# Altium schematic sheet BulbCommander1.SchDoc
size A4
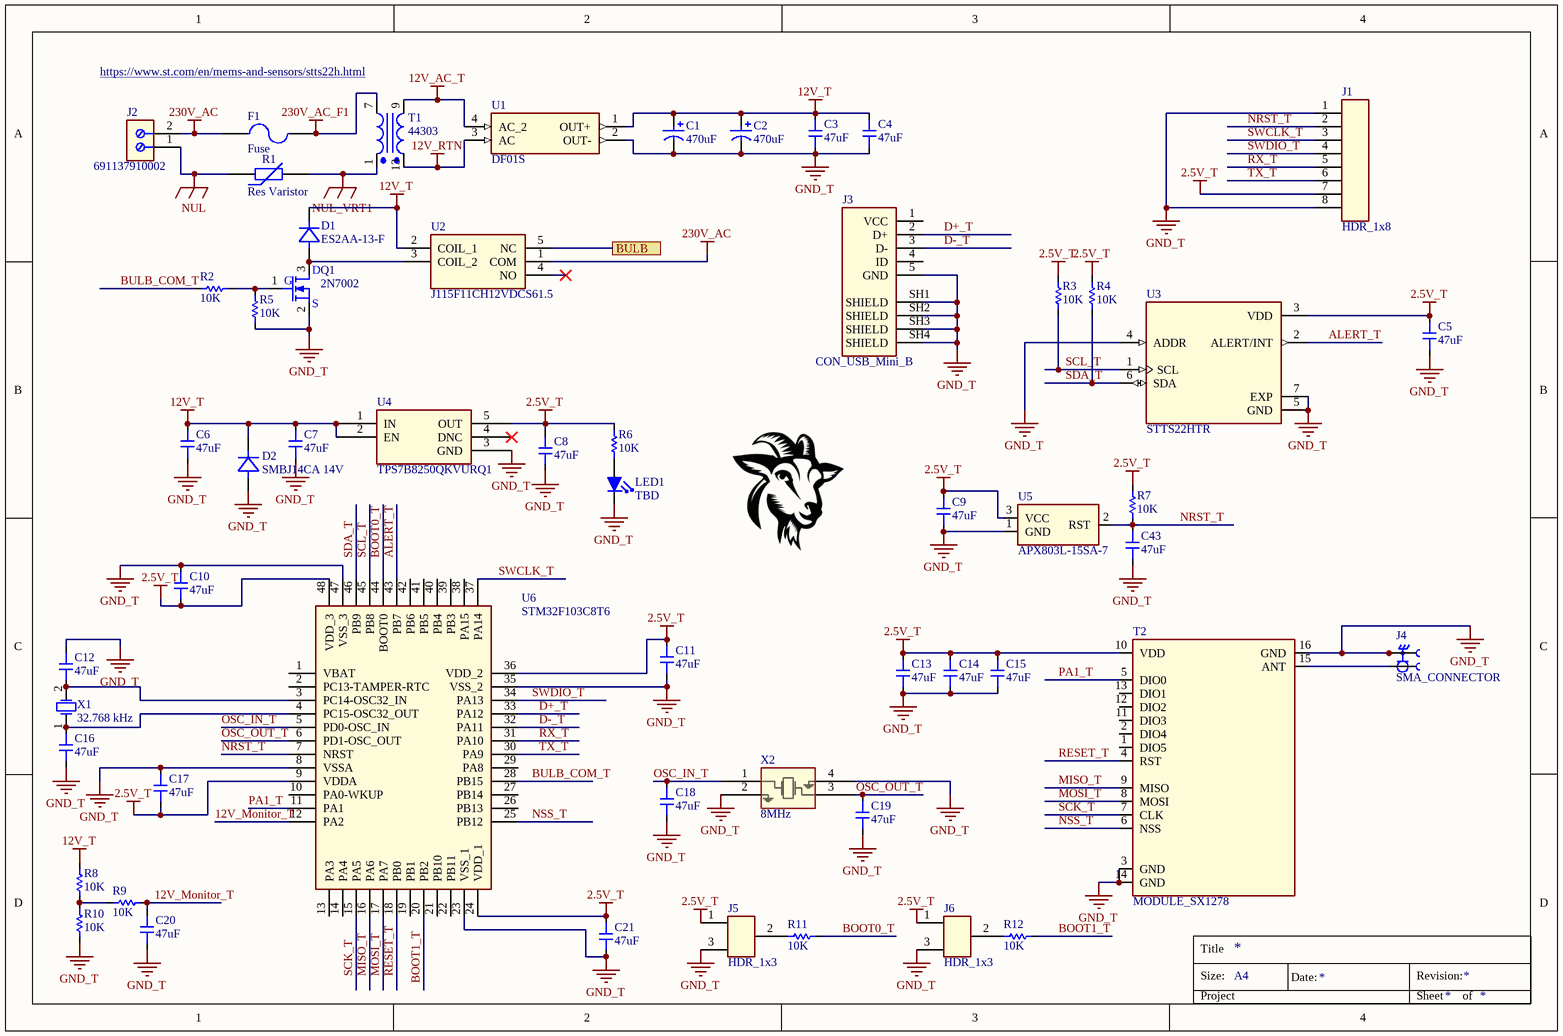
[diagram p0: BulbCommander1.SchDoc]

## Parts
C1  value 470uF  [WCAP-ASLL_D16H17]  (hidden comment: Cap Pol1)
C2  value 470uF  [WCAP-ASLL_D16H17]  (hidden comment: Cap Pol1)
C3  47uF  [2220]
C4  47uF  [2220]
C5  47uF  [CASE0603]
C6  47uF  [1206]
C7  47uF  [1206]
C8  47uF  [1206]
C9  47uF  [CASE0603]
C10  47uF  [CASE0603]
C11  47uF  [CASE0603]
C12  47uF  [CASE0603]
C13  47uF  [CASE0603]
C14  47uF  [CASE0603]
C15  47uF  [CASE0603]
C16  47uF  [CASE0603]
C17  47uF  [CASE0603]
C18  47uF  [CASE0603]
C19  47uF  [CASE0603]
C20  47uF  [CASE0603]
C21  47uF  [CASE0603]
C43  47uF  [CASE0603]
D1  ES2AA-13-F  [SMA_DIODE]
D2  SMBJ14CA 14V  [SMBJSeries_LTF-M]
F1  Fuse  [FUSE]
J1  HDR_1x8  [Header_1x8_2.54_Male]
J2  691137910002  [691137910002]
J3  CON_USB_Mini_B  [CUI_UJ2-MBH-4-SMT]
J4  SMA_CONNECTOR  [LPRS_SMA_CONNECTOR]
J5  HDR_1x3  [Header_1x3_2.54_Male]
J6  HDR_1x3  [Header_1x3_2.54_Male]
LED1  TBD  [CASE0603]
Q1  2N7002  [SOT23-3]
R1  Res Varistor  [AXIAL-0.3]
R2  10K  [CASE0603]
R3  10K  [CASE0603]
R4  10K  [CASE0603]
R5  10K  [CASE0603]
R6  10K  [CASE0603]
R7  10K  [CASE0603]
R8  10K  [CASE0603]
R9  10K  [CASE0603]
R10  10K  [CASE0603]
R11  10K  [CASE0603]
R12  10K  [CASE0603]
T1  44303  [TRAF_44303]
T2  MODULE_SX1278  [LORA SX1278]
U1  DF01S  [SOT508P985X260-4N]
U2  J115F11CH12VDCS61.5  [J115F11CH12VDCS615U]
U3  STTS22HTR  [Sensor_6-UDFN]
U4  TPS7B8250QKVURQ1  [SOT_QKVURQ1_TEX]
U5  APX803L-15SA-7  [SOT23-3]
U6  STM32F103C8T6  [QFP50P900X900X160-48N]
X1  32.768 kHz  [XTAL_ECS-.327-12.5-34B-C-TR]
X2  8MHz  [XTAL4P_ABM3B_ABR]

## Ports
BULB

## Nets
2.5V_T: C5.2 C8.2 C9.2 C10.1 C11.2 C13.2 C14.2 C15.2 C17.2 C21.2 J1.7 J5.1 J6.1 R3.2 R4.2 R6.2 R7.2 T2.10(VDD) U3.3(VDD) U4.5(OUT) U5.3(VCC) U6.9(VDDA) U6.24(VDD_1) U6.36(VDD_2) U6.48(VDD_3)
12V_AC_T: T1.9(PRI1) U1.4(AC_2)
12V_RTN: T1.13(SEC) U1.3(AC)
12V_T: C1.1 C2.1 C3.2 C4.2 C6.2 C7.2 D1.1 D2.1 R8.2 U1.1(OUT+) U2.2(COIL_1) U4.1(IN) U4.2(EN)
230V_AC: F1.1 J2.2 U2.1(COM)
230V_AC_F1: F1.2 T1.7(PRI1)
GND_T: C1.2 C2.2 C3.1 C4.1 C5.1 C6.1 C7.1 C8.1 C9.1 C10.2 C11.1 C12.2 C13.1 C14.1 C15.1 C16.2 C17.1 C18.2 C19.2 C20.2 C21.1 C43.1 D2.2 J1.1 J1.8 J3.5(GND) J3.SH1(SHIELD) J3.SH2(SHIELD) J3.SH3(SHIELD) J3.SH4(SHIELD) J4.G1 J4.G2 J4.G3 J4.G4 J5.3 J6.3 LED1.2(K) Q1.2(S) R5.1 R10.1 T2.3(GND) T2.14(GND) T2.16(GND) U1.2(OUT-) U3.4(ADDR) U3.5(GND) U3.7(EXP) U4.3(GND) U5.1(GND) U6.8(VSSA) U6.23(VSS_1) U6.35(VSS_2) U6.47(VSS_3) X2.2 X2.4
NUL: J2.1 R1.1
NUL_VRT1: R1.2 T1.1(PRI1)
12V_Monitor_T: C20.1 R9.2 U6.12(PA2)
ALERT_T: U3.2(ALERT/INT) U6.43(PB7)
BOOT0_T: R11.1 U6.44(BOOT0)
BOOT1_T: R12.1 U6.20(PB2)
BULB: U2.5(NC) ; port BULB
BULB_COM_T: R2.2 U6.28(PB15)
D+_T: J3.2(D+) U6.33(PA12)
D-_T: J3.3(D-) U6.32(PA11)
MISO_T: T2.9(MISO) U6.16(PA6)
MOSI_T: T2.8(MOSI) U6.17(PA7)
NRST_T: C43.2 J1.2 R7.1 U5.2(RST) U6.7(NRST)
NSS_T: T2.6(NSS) U6.25(PB12)
OSC_IN_T: C18.1 U6.5(PD0-OSC_IN) X2.1
OSC_OUT_T: C19.1 U6.6(PD1-OSC_OUT) X2.3
PA1_T: T2.5(DIO0) U6.11(PA1)
RESET_T: T2.4(RST) U6.18(PB0)
RX_T: J1.5 U6.31(PA10)
SCK_T: T2.7(CLK) U6.15(PA5)
SCL_T: R3.1 U3.1(SCL) U6.45(PB8)
SDA_T: R4.1 U3.6(SDA) U6.46(PB9)
SWCLK_T: J1.3 U6.37(PA14)
SWDIO_T: J1.4 U6.34(PA13)
TX_T: J1.6 U6.30(PA9)
NetC12_1: C12.1 U6.3(PC14-OSC32_IN) X1.2(OSC2)
NetC16_1: C16.1 U6.4(PC15-OSC32_OUT) X1.1(OSC1)
NetD1_2: D1.2 Q1.3(D) U2.3(COIL_2)
NetJ4_1: J4.1 T2.15(ANT)
NetJ5_2: J5.2 R11.2
NetJ6_2: J6.2 R12.2
NetLED1_1: LED1.1(A) R6.1
NetQ1_1: Q1.1(G) R2.1 R5.2
NetR8_1: R8.1 R9.1 R10.2

Not connected (* = marked no-connect by the designer): J3 1(VCC) 4(ID); T2 1(DIO5) 2(DIO4) 11(DIO3) 12(DIO2) 13(DIO1); U2 4(NO)*; U4 4(DNC)*; U6 1(VBAT) 2(PC13-TAMPER-RTC) 10(PA0-WKUP) 13(PA3) 14(PA4) 19(PB1) 21(PB10) 22(PB11) 26(PB13) 27(PB14) 29(PA8) 38(PA15) 39(PB3) 40(PB4) 41(PB5) 42(PB6)

## Notes on the sheet
- https://www.st.com/en/mems-and-sensors/stts22h.html
- Title
- Size:
- A4
- Date:
- Revision:
- Project
- Sheet
- of

## Library data of the parts
C1 C2 = Capacitor_Pol_470uF: Published: 8-Jun-2000; LatestRevisionDate: 17-Jul-2002; LatestRevisionNote: Re-released for DXP Platform.; PackageReference: RB7.6-15; Publisher: Altium Limited; PackageDescription: Polarized Capacitor (Radial); 2 Leads
C3 C4 = Capacitor_47uF_2220: CAP CER 47uF 20% 35V X7R 2220; MFR: TBD; MFR PN: TBD; Supplier: TBD; Supplier PN: TBD; Datasheet: TBD
C5-C21 C43 = Capacitor_47uF_1206: CAP CER 47uF 20% 35V X7R 2220; MFR: TBD; MFR PN: TBD; Supplier: TBD; Supplier PN: TBD; Datasheet: TBD
D1 = Diode_SMA: DIODE STANDARD 50V 2A SMA; MFR: Diodes Incoprated; MFR PN: ES2AA-13-F; SUpplier: DigiKey; Supplier PN: ES2AA-FDICT-ND; Datasheet: https://www.digikey.ro/en/products/detail/diodes-incorporated/ES2AA-13-F/765452?curr=usd&utm_campaign=buynow&utm_medium=aggregator&utm_source=octopart
D2 = Diode_SMBJ14CA: SMBJ14CA TVS DIODE 14V; Mfr_Name: Littelfuse Inc
J1 = HDR_1x8: HDR MALE 2.54MM PCB; MFR: Wurth; MFR PN: 691210910002; Datasheet: https://www.digikey.ro/en/products/detail/w%C3%BCrth-elektronik/691210910002/10668428?s=N4IgTCBcDaIGwE4CMYkAZlqxAugXyA; Supplier PN: 732-691210910002-ND; Supplier: Digi Key
J2 = CON_1x2: TERM BLOCK 2P HORIZON 7.5MM PCB; MFR: Wurth; MFR PN: 691101710002; Datasheet: https://www.digikey.ro/en/products/detail/w%C3%BCrth-elektronik/691101710002/2060522?s=N4IgTCBcDaIGwE4CMSAMSDsbWogXQF8g; Supplier PN: 732-2026-ND; Supplier: Digi Key
J3 = CON_USB_Mini_B: USB B mini; MFR: Same Sky; MFR PN: 102-5892-1-ND; Datasheet: https://www.digikey.ro/en/products/detail/same-sky-formerly-cui-devices/UJ2-MBH-4-SMT-TR/6188086; Supplier: DigiKey; Supplier PN: 102-5892-1-ND
J4 = SMA_CONNECTOR: Straight SMA Connector; MP: altium_native_batch; Value: *; Package: None; Availability: Unavailable; Price: None
J5 J6 = HDR_1x3: HDR MALE 3 x 2.54MM PCB; MFR: Wurth; MFR PN: 691210910002; Datasheet: https://www.digikey.ro/en/products/detail/w%C3%BCrth-elektronik/691210910002/10668428?s=N4IgTCBcDaIGwE4CMYkAZlqxAugXyA; Supplier PN: 732-691210910002-ND; Supplier: Digi Key
LED1 = LED: Typical INFRARED GaAs LED
Q1 = Transistor_NMOS: MOSFET N-CH 60V 280MA SOT23-3; MFR: Microchip; MFR PN: 2N7002-G; Supplier: 689-2N7002-G; Supplier PN: 689-2N7002-G; Datasheetr: https://eu.mouser.com/ProductDetail/Microchip-Technology/2N7002-G?qs=D%2FHwGy7fPj%2F0m3YgJ%252BOEvg%3D%3D&gad_source=1&gclid=CjwKCAiA-vOsBhAAEiwAIWR0TUe7q_QostOicZHu1AHXgQXTk64doIjIByY-NhPhM9vjgvrvT5qG4BoC-HkQAvD_BwE&_gl=1*1hvi63b*_ga*MjAyNjQwOTA4MS4xNzA0NjI4Mjkx*_ga_15W4STQT4T*MTcwNDgyMjg3Ni4yLjEuMTcwNDgyMjg3Ni42MC4wLjA.
R1 = Res Varistor: Varistor (Voltage-Sensitive Resistor); Published: 24-Mar-1999; LatestRevisionDate: 29-May-2009; LatestRevisionNote: IPC-7351 Footprint Added.; PackageVersion: Mar-2003; PackageReference: 6-0805; Publisher: Altium Limited; PackageDescription: Chip Resistor 0805 Case Size; Code_IPC: RESC2012
R2-R12 = Resistor_10K_0603: RES 10K 1% 1/10W 0603; MFR: YAGEO; MFR PN: RC0603FR-0710KL; Supplier: Mouser; Supplier PN: 603-RC0603FR-0710KL; Datasheet: https://eu.mouser.com/ProductDetail/YAGEO/RC0603FR-0710KL?qs=grNVn54RoB%252B3GtjbJj3wJQ%3D%3D
T1 = TRAF_44303: PCB Transformer, EI 54 x 18.8, Encapsulated Safety Isolating, 230V, 12V, 16 VA, 50Hz / 60Hz; MFR: MYRRA; Datasheet: https://ro.farnell.com/myrra/44303/transformer-16va-12v/dp/1689094; MFR PN: 44303; Supplier: Farnel; Supplier PN: 1689094
T2 = MODULE_SX1278: MODULE_SX1278 LORA 433 MHz; Datasheet: https://www.aliexpress.com/item/1005001894642323.html; MFR: LORA; MFR PN: LORA; Supplier: LORA; Supplier PN: LORA
U1 = RECT_DF01S: BRIDGE RECT 1P 100V 1.5A 4-SDIP; MFR: onsemi; Datasheet: https://www.onsemi.com/download/data-sheet/pdf/df10s-d.pdf; MFR PN: DF01S; Supplier: Digi Key; Supplier PN: DF01SCT-ND
U2 = RELAY_J115F11CH12VDCS61.5: RELAY GEN PURPOSE SPDT 50A 12V; MFR: CIT Relay and Switch; Datasheet: https://www.citrelay.com/Catalog%20Pages/RelayCatalog/J115F%2050amp.pdf; MFR PN: J115F11CH12VDCS61.5; Supplier: Digi Key; Supplier PN: J115F11CH12VDCS61.2449-J115F11CH12VDCS61.5-ND5U
U3 = SENSOR_STTS22HTR: Low-voltage, ultralow-power, 0.5°C accuracy I²C/SMBus 3.0 temperature sensor; MFR: STMicroelectronics; MFR PN: STTS22HTR; Supplier PN: 497-STTS22HCT-ND; Supplier: Digi-Key; Datasheet: https://www.digikey.com/en/products/detail/stmicroelectronics/STTS22HTR/10668399
U4 = CONV_LDO_TPS7B8250QKVURQ1: MFR: Texas Instruments; MFR PN: TPS7B8250QKVURQ1; Supplier PN: 296-TPS7B8250QKVURQ1CT-ND; Supplier: DigiKey; Datasheet: https://www.digikey.ro/en/products/detail/texas-instruments/TPS7B8250QKVURQ1/12352207?s=N4IgTCBcDaICoAUDKB2AQgDjAVgAwEUBpANQFUAlfARhAF0BfIA
U5 = IC_APX803L-15SA-7: Supervisor Open Drain or Open Collector 1 Channel SOT-23-3; MFR: Diodes Incorporated; Datasheet: https://www.aliexpress.com/item/1005001894642323.html; MFR PN: APX803L-15SA-7; Supplier: Digi key; Supplier PN: 31-APX803L-15SA-7CT-ND
U6 = IC_STM32F103C8T6: IC MCU 32BIT 64KB FLASH 48LQFP; MFR: STMicroelectronics; Datasheet: https://www.st.com/resource/en/datasheet/stm32f103cb.pdf; MFR PN: STM32F103C8T6; Supplier: Digi Key; Supplier PN: 497-6063-ND
X1 = Crystal_ECS-.327-12.5-34B-C-TR: 32.768 kHz ±10ppm Crystal 12.5pF 70 kOhms 2-SMD, No Lead; MFR: ECS; MFR PN: ECS-.327-12.5-34B-C-TR; Datasheet: https://www.digikey.ro/en/products/detail/ecs-inc/ECS-327-12-5-34B-C-TR/3927328; Supplier PN: XC1968CT-ND; Supplier: Digi Key
X2 = ABM3B-8.000MHZ-10-1UT: 8 MHz Crystal; MFR: Abracon; MFR PN: ABM3B-8.000MHZ-10-1-U-T; Datasheet: https://www.digikey.ro/en/products/detail/abracon-llc/ABM3B-8-000MHZ-10-1-U-T/1873167; Supplier: Digi-Key; Supplier PN: 535-9721-1-ND
F1 = Fuse: Published: 8-Jun-2000; LatestRevisionDate: 17-Jul-2002; LatestRevisionNote: Re-released for DXP Platform.; PackageReference: PIN-W2/E2.8; Publisher: Altium Limited; PackageDescription: Thru-Hole; 2 Leads